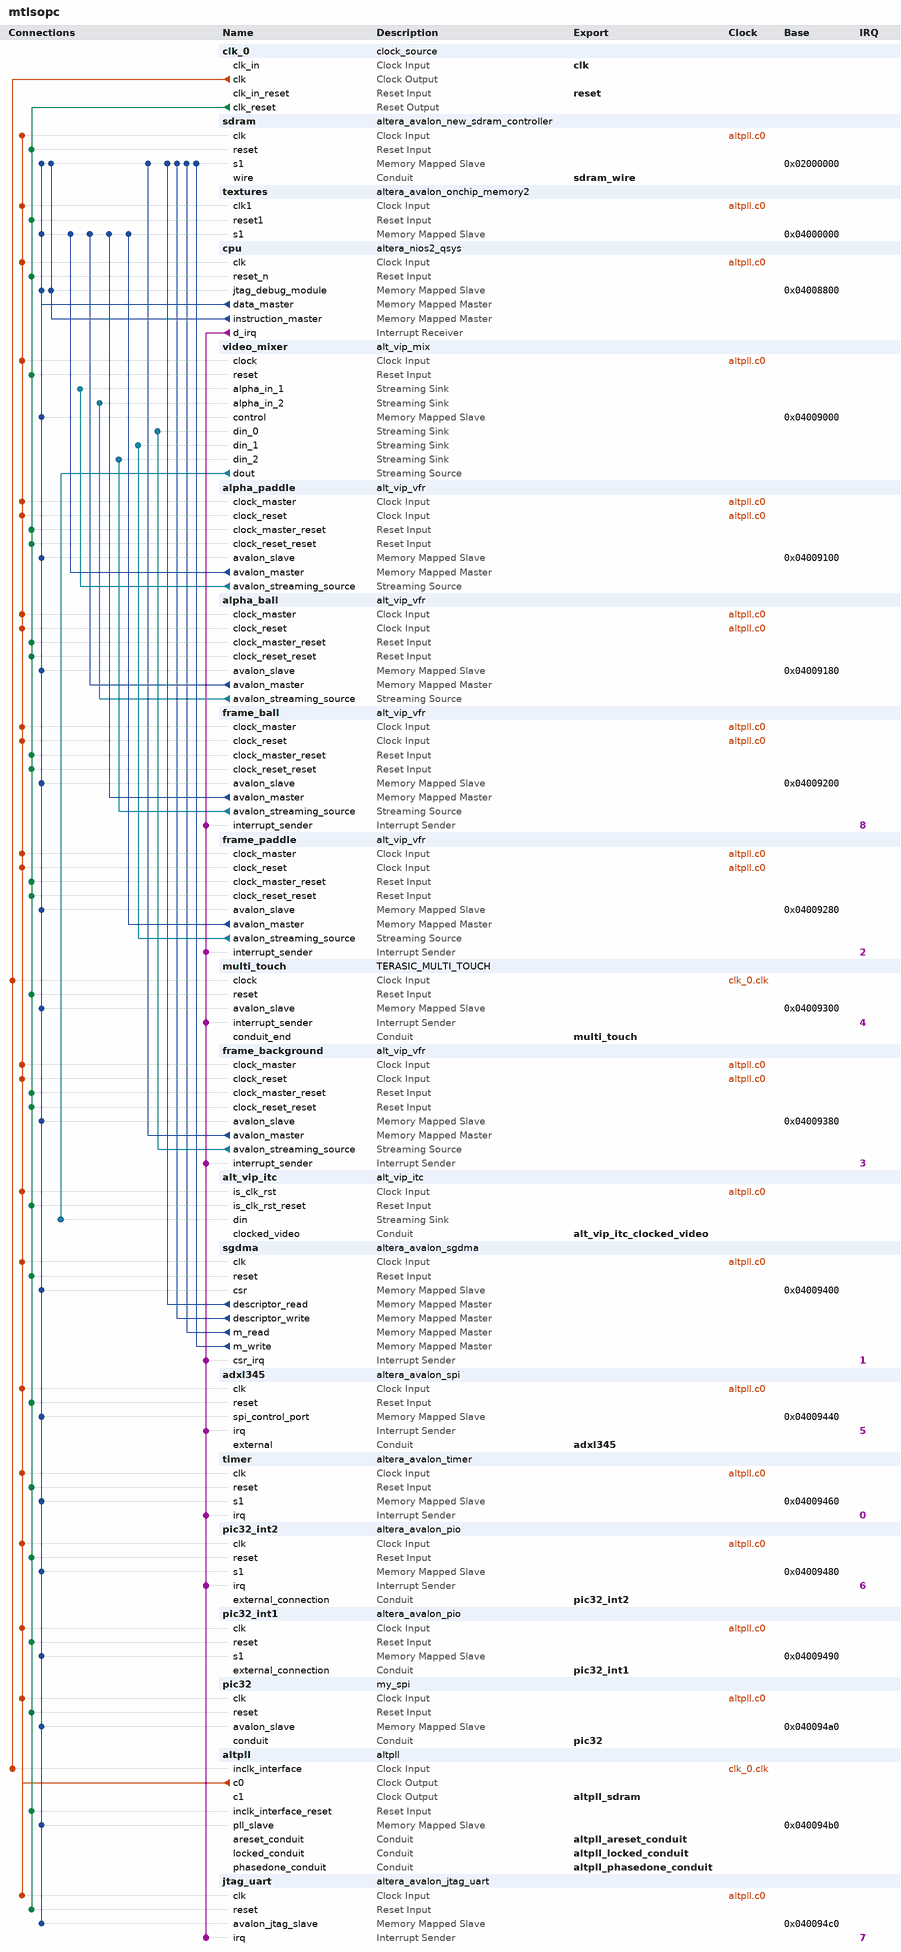
[diagram p0: system contents]
# Platform Designer (Qsys) system mtlsopc, Cyclone IV E EP4CE22F17C6
# Parameters at their usual value, and those the tool derives, are not listed.
package require -exact qsys 13.1
create_system mtlsopc
set_project_property DEVICE_FAMILY {Cyclone IV E}
set_project_property DEVICE EP4CE22F17C6

add_instance clk_0 clock_source 13.1
set_instance_parameter_value clk_0 clockFrequency 50000000

add_instance sdram altera_avalon_new_sdram_controller 13.1
set_instance_parameter_value sdram TAC 5.5
set_instance_parameter_value sdram TRCD 20.0
set_instance_parameter_value sdram TRP 20.0
set_instance_parameter_value sdram casLatency 2
set_instance_parameter_value sdram columnWidth 9
set_instance_parameter_value sdram dataWidth 16
set_instance_parameter_value sdram generateSimulationModel false
set_instance_parameter_value sdram model single_Micron_MT48LC4M32B2_7_chip
set_instance_parameter_value sdram numberOfBanks 4
set_instance_parameter_value sdram numberOfChipSelects 1
set_instance_parameter_value sdram powerUpDelay 100.0
set_instance_parameter_value sdram refreshPeriod 15.625
set_instance_parameter_value sdram rowWidth 13

add_instance textures altera_avalon_onchip_memory2 13.1
set_instance_parameter_value textures dataWidth 32
set_instance_parameter_value textures dualPort false
set_instance_parameter_value textures initMemContent true
set_instance_parameter_value textures initializationFileName onchip_mem.hex
set_instance_parameter_value textures memorySize 32768
set_instance_parameter_value textures singleClockOperation true

add_instance cpu altera_nios2_qsys 13.1
set_instance_parameter_value cpu resetSlave sdram.s1
set_instance_parameter_value cpu mmu_TLBMissExcSlave None
set_instance_parameter_value cpu exceptionSlave sdram.s1
set_instance_parameter_value cpu breakSlave cpu.jtag_debug_module
set_instance_parameter_value cpu impl Fast
set_instance_parameter_value cpu icache_size 4096
set_instance_parameter_value cpu dcache_size 4096

add_instance video_mixer alt_vip_mix 13.1
set_instance_parameter_value video_mixer PARAMETERISATION {<mixerParams><MIX_NAME>mixer</MIX_NAME><MIX_ALPHA_ENABLED>true</MIX_ALPHA_ENABLED><MIX_ALPHA_BPS>8</MIX_ALPHA_BPS><MIX_CHANNELS_IN_SEQ>1</MIX_CHANNELS_IN_SEQ><MIX_CHANNELS_IN_PAR>3</MIX_CHANNELS_IN_PAR><MIX_BPS>8</MIX_BPS><MIX_NUM_LAYERS>3</MIX_NUM_LAYERS><MIX_RUNTIME_MAX_WIDTH>800</MIX_RUNTIME_MAX_WIDTH><MIX_RUNTIME_MAX_HEIGHT>480</MIX_RUNTIME_MAX_HEIGHT></mixerParams>}

add_instance alpha_paddle alt_vip_vfr 13.1
set_instance_parameter_value alpha_paddle NUMBER_OF_CHANNELS_IN_PARALLEL 1
set_instance_parameter_value alpha_paddle MAX_IMAGE_WIDTH 256
set_instance_parameter_value alpha_paddle MAX_IMAGE_HEIGHT 32
set_instance_parameter_value alpha_paddle MEM_PORT_WIDTH 32
set_instance_parameter_value alpha_paddle RMASTER_FIFO_DEPTH 128
set_instance_parameter_value alpha_paddle CLOCKS_ARE_SEPARATE 0

add_instance alpha_ball alt_vip_vfr 13.1
set_instance_parameter_value alpha_ball NUMBER_OF_CHANNELS_IN_PARALLEL 1
set_instance_parameter_value alpha_ball MAX_IMAGE_WIDTH 32
set_instance_parameter_value alpha_ball MAX_IMAGE_HEIGHT 32
set_instance_parameter_value alpha_ball MEM_PORT_WIDTH 32
set_instance_parameter_value alpha_ball RMASTER_FIFO_DEPTH 128
set_instance_parameter_value alpha_ball CLOCKS_ARE_SEPARATE 0

add_instance frame_ball alt_vip_vfr 13.1
set_instance_parameter_value frame_ball NUMBER_OF_CHANNELS_IN_PARALLEL 3
set_instance_parameter_value frame_ball MAX_IMAGE_WIDTH 32
set_instance_parameter_value frame_ball MAX_IMAGE_HEIGHT 32
set_instance_parameter_value frame_ball MEM_PORT_WIDTH 32
set_instance_parameter_value frame_ball RMASTER_FIFO_DEPTH 128
set_instance_parameter_value frame_ball CLOCKS_ARE_SEPARATE 0

add_instance frame_paddle alt_vip_vfr 13.1
set_instance_parameter_value frame_paddle NUMBER_OF_CHANNELS_IN_PARALLEL 3
set_instance_parameter_value frame_paddle MAX_IMAGE_WIDTH 256
set_instance_parameter_value frame_paddle MAX_IMAGE_HEIGHT 32
set_instance_parameter_value frame_paddle MEM_PORT_WIDTH 32
set_instance_parameter_value frame_paddle RMASTER_FIFO_DEPTH 128
set_instance_parameter_value frame_paddle CLOCKS_ARE_SEPARATE 0

add_instance multi_touch TERASIC_MULTI_TOUCH 1.0

add_instance frame_background alt_vip_vfr 13.1
set_instance_parameter_value frame_background NUMBER_OF_CHANNELS_IN_PARALLEL 3
set_instance_parameter_value frame_background MAX_IMAGE_WIDTH 800
set_instance_parameter_value frame_background MAX_IMAGE_HEIGHT 480
set_instance_parameter_value frame_background MEM_PORT_WIDTH 32
set_instance_parameter_value frame_background RMASTER_FIFO_DEPTH 128
set_instance_parameter_value frame_background CLOCKS_ARE_SEPARATE 0

add_instance alt_vip_itc alt_vip_itc 13.1
set_instance_parameter_value alt_vip_itc NUMBER_OF_COLOUR_PLANES 3
set_instance_parameter_value alt_vip_itc INTERLACED 1
set_instance_parameter_value alt_vip_itc H_ACTIVE_PIXELS 800
set_instance_parameter_value alt_vip_itc V_ACTIVE_LINES 480
set_instance_parameter_value alt_vip_itc FIFO_DEPTH 800
set_instance_parameter_value alt_vip_itc THRESHOLD 799
set_instance_parameter_value alt_vip_itc H_SYNC_LENGTH 30
set_instance_parameter_value alt_vip_itc H_FRONT_PORCH 210
set_instance_parameter_value alt_vip_itc H_BACK_PORCH 16
set_instance_parameter_value alt_vip_itc V_SYNC_LENGTH 13
set_instance_parameter_value alt_vip_itc V_FRONT_PORCH 22
set_instance_parameter_value alt_vip_itc V_BACK_PORCH 10

add_instance sgdma altera_avalon_sgdma 13.1
set_instance_parameter_value sgdma enableBurstTransfers false
set_instance_parameter_value sgdma enableUnalignedTransfers false
set_instance_parameter_value sgdma readBlockDataWidth 16
set_instance_parameter_value sgdma sinkErrorWidth 0
set_instance_parameter_value sgdma sourceErrorWidth 0
set_instance_parameter_value sgdma transferMode MEMORY_TO_MEMORY
set_instance_parameter_value sgdma writeBurstcountWidth 4

add_instance adxl345 altera_avalon_spi 13.1
set_instance_parameter_value adxl345 clockPhase 1
set_instance_parameter_value adxl345 clockPolarity 1
set_instance_parameter_value adxl345 dataWidth 8
set_instance_parameter_value adxl345 masterSPI true
set_instance_parameter_value adxl345 numberOfSlaves 1
set_instance_parameter_value adxl345 targetClockRate 2000000

add_instance timer altera_avalon_timer 13.1
set_instance_parameter_value timer period 1
set_instance_parameter_value timer periodUnits MSEC

add_instance pic32_int2 altera_avalon_pio 13.1
set_instance_parameter_value pic32_int2 bitClearingEdgeCapReg true
set_instance_parameter_value pic32_int2 captureEdge true
set_instance_parameter_value pic32_int2 direction Input
set_instance_parameter_value pic32_int2 generateIRQ true
set_instance_parameter_value pic32_int2 irqType EDGE
set_instance_parameter_value pic32_int2 width 1

add_instance pic32_int1 altera_avalon_pio 13.1
set_instance_parameter_value pic32_int1 direction Output
set_instance_parameter_value pic32_int1 width 1

add_instance pic32 my_spi 1.0

add_instance altpll altpll 13.1
set_instance_parameter_value altpll INCLK0_INPUT_FREQUENCY 20000
set_instance_parameter_value altpll CLK0_MULTIPLY_BY 2
set_instance_parameter_value altpll CLK1_MULTIPLY_BY 2
set_instance_parameter_value altpll CLK0_DIVIDE_BY 1
set_instance_parameter_value altpll CLK1_DIVIDE_BY 1
set_instance_parameter_value altpll CLK1_PHASE_SHIFT -3000
set_instance_parameter_value altpll CLK1_DUTY_CYCLE 50
set_instance_parameter_value altpll PORT_clk1 PORT_USED
set_instance_parameter_value altpll PORT_clk2 PORT_UNUSED
set_instance_parameter_value altpll PORT_clk3 PORT_UNUSED
set_instance_parameter_value altpll PORT_ARESET PORT_UNUSED
set_instance_parameter_value altpll PORT_LOCKED PORT_UNUSED

add_instance jtag_uart altera_avalon_jtag_uart 13.1
set_instance_parameter_value jtag_uart simInteractiveOptions NO_INTERACTIVE_WINDOWS

# connections
add_connection altpll.c0 adxl345.clk clock
add_connection altpll.c0 alpha_ball.clock_master clock
add_connection altpll.c0 alpha_ball.clock_reset clock
add_connection altpll.c0 alpha_paddle.clock_master clock
add_connection altpll.c0 alpha_paddle.clock_reset clock
add_connection altpll.c0 alt_vip_itc.is_clk_rst clock
add_connection altpll.c0 cpu.clk clock
add_connection altpll.c0 frame_background.clock_master clock
add_connection altpll.c0 frame_background.clock_reset clock
add_connection altpll.c0 frame_ball.clock_master clock
add_connection altpll.c0 frame_ball.clock_reset clock
add_connection altpll.c0 frame_paddle.clock_master clock
add_connection altpll.c0 frame_paddle.clock_reset clock
add_connection altpll.c0 jtag_uart.clk clock
add_connection altpll.c0 pic32.clk clock
add_connection altpll.c0 pic32_int1.clk clock
add_connection altpll.c0 pic32_int2.clk clock
add_connection altpll.c0 sdram.clk clock
add_connection altpll.c0 sgdma.clk clock
add_connection altpll.c0 textures.clk1 clock
add_connection altpll.c0 timer.clk clock
add_connection altpll.c0 video_mixer.clock clock
add_connection clk_0.clk altpll.inclk_interface clock
add_connection clk_0.clk multi_touch.clock clock
add_connection clk_0.clk_reset adxl345.reset reset
add_connection clk_0.clk_reset alpha_ball.clock_master_reset reset
add_connection clk_0.clk_reset alpha_ball.clock_reset_reset reset
add_connection clk_0.clk_reset alpha_paddle.clock_master_reset reset
add_connection clk_0.clk_reset alpha_paddle.clock_reset_reset reset
add_connection clk_0.clk_reset alt_vip_itc.is_clk_rst_reset reset
add_connection clk_0.clk_reset altpll.inclk_interface_reset reset
add_connection clk_0.clk_reset cpu.reset_n reset
add_connection clk_0.clk_reset frame_background.clock_master_reset reset
add_connection clk_0.clk_reset frame_background.clock_reset_reset reset
add_connection clk_0.clk_reset frame_ball.clock_master_reset reset
add_connection clk_0.clk_reset frame_ball.clock_reset_reset reset
add_connection clk_0.clk_reset frame_paddle.clock_master_reset reset
add_connection clk_0.clk_reset frame_paddle.clock_reset_reset reset
add_connection clk_0.clk_reset jtag_uart.reset reset
add_connection clk_0.clk_reset multi_touch.reset reset
add_connection clk_0.clk_reset pic32.reset reset
add_connection clk_0.clk_reset pic32_int1.reset reset
add_connection clk_0.clk_reset pic32_int2.reset reset
add_connection clk_0.clk_reset sdram.reset reset
add_connection clk_0.clk_reset sgdma.reset reset
add_connection clk_0.clk_reset textures.reset1 reset
add_connection clk_0.clk_reset timer.reset reset
add_connection clk_0.clk_reset video_mixer.reset reset
add_connection alpha_ball.avalon_master textures.s1 avalon
set_connection_parameter_value alpha_ball.avalon_master/textures.s1 baseAddress 0x04000000
add_connection alpha_paddle.avalon_master textures.s1 avalon
set_connection_parameter_value alpha_paddle.avalon_master/textures.s1 baseAddress 0x04000000
add_connection cpu.data_master adxl345.spi_control_port avalon
set_connection_parameter_value cpu.data_master/adxl345.spi_control_port baseAddress 0x04009440
add_connection cpu.data_master alpha_ball.avalon_slave avalon
set_connection_parameter_value cpu.data_master/alpha_ball.avalon_slave baseAddress 0x04009180
add_connection cpu.data_master alpha_paddle.avalon_slave avalon
set_connection_parameter_value cpu.data_master/alpha_paddle.avalon_slave baseAddress 0x04009100
add_connection cpu.data_master altpll.pll_slave avalon
set_connection_parameter_value cpu.data_master/altpll.pll_slave baseAddress 0x040094b0
add_connection cpu.data_master cpu.jtag_debug_module avalon
set_connection_parameter_value cpu.data_master/cpu.jtag_debug_module baseAddress 0x04008800
add_connection cpu.data_master frame_background.avalon_slave avalon
set_connection_parameter_value cpu.data_master/frame_background.avalon_slave baseAddress 0x04009380
add_connection cpu.data_master frame_ball.avalon_slave avalon
set_connection_parameter_value cpu.data_master/frame_ball.avalon_slave baseAddress 0x04009200
add_connection cpu.data_master frame_paddle.avalon_slave avalon
set_connection_parameter_value cpu.data_master/frame_paddle.avalon_slave baseAddress 0x04009280
add_connection cpu.data_master jtag_uart.avalon_jtag_slave avalon
set_connection_parameter_value cpu.data_master/jtag_uart.avalon_jtag_slave baseAddress 0x040094c0
add_connection cpu.data_master multi_touch.avalon_slave avalon
set_connection_parameter_value cpu.data_master/multi_touch.avalon_slave baseAddress 0x04009300
add_connection cpu.data_master pic32.avalon_slave avalon
set_connection_parameter_value cpu.data_master/pic32.avalon_slave baseAddress 0x040094a0
add_connection cpu.data_master pic32_int1.s1 avalon
set_connection_parameter_value cpu.data_master/pic32_int1.s1 baseAddress 0x04009490
add_connection cpu.data_master pic32_int2.s1 avalon
set_connection_parameter_value cpu.data_master/pic32_int2.s1 baseAddress 0x04009480
add_connection cpu.data_master sdram.s1 avalon
set_connection_parameter_value cpu.data_master/sdram.s1 baseAddress 0x02000000
add_connection cpu.data_master sgdma.csr avalon
set_connection_parameter_value cpu.data_master/sgdma.csr baseAddress 0x04009400
add_connection cpu.data_master textures.s1 avalon
set_connection_parameter_value cpu.data_master/textures.s1 baseAddress 0x04000000
add_connection cpu.data_master timer.s1 avalon
set_connection_parameter_value cpu.data_master/timer.s1 baseAddress 0x04009460
add_connection cpu.data_master video_mixer.control avalon
set_connection_parameter_value cpu.data_master/video_mixer.control baseAddress 0x04009000
add_connection cpu.instruction_master cpu.jtag_debug_module avalon
set_connection_parameter_value cpu.instruction_master/cpu.jtag_debug_module baseAddress 0x04008800
add_connection cpu.instruction_master sdram.s1 avalon
set_connection_parameter_value cpu.instruction_master/sdram.s1 baseAddress 0x02000000
add_connection frame_background.avalon_master sdram.s1 avalon
set_connection_parameter_value frame_background.avalon_master/sdram.s1 baseAddress 0x02000000
add_connection frame_ball.avalon_master textures.s1 avalon
set_connection_parameter_value frame_ball.avalon_master/textures.s1 baseAddress 0x04000000
add_connection frame_paddle.avalon_master textures.s1 avalon
set_connection_parameter_value frame_paddle.avalon_master/textures.s1 baseAddress 0x04000000
add_connection sgdma.descriptor_read sdram.s1 avalon
set_connection_parameter_value sgdma.descriptor_read/sdram.s1 baseAddress 0x02000000
add_connection sgdma.descriptor_write sdram.s1 avalon
set_connection_parameter_value sgdma.descriptor_write/sdram.s1 baseAddress 0x02000000
add_connection sgdma.m_read sdram.s1 avalon
set_connection_parameter_value sgdma.m_read/sdram.s1 baseAddress 0x02000000
add_connection sgdma.m_write sdram.s1 avalon
set_connection_parameter_value sgdma.m_write/sdram.s1 baseAddress 0x02000000
add_connection alpha_ball.avalon_streaming_source video_mixer.alpha_in_2 avalon_streaming
add_connection alpha_paddle.avalon_streaming_source video_mixer.alpha_in_1 avalon_streaming
add_connection frame_background.avalon_streaming_source video_mixer.din_0 avalon_streaming
add_connection frame_ball.avalon_streaming_source video_mixer.din_2 avalon_streaming
add_connection frame_paddle.avalon_streaming_source video_mixer.din_1 avalon_streaming
add_connection video_mixer.dout alt_vip_itc.din avalon_streaming
add_connection cpu.d_irq adxl345.irq interrupt
set_connection_parameter_value cpu.d_irq/adxl345.irq irqNumber 5
add_connection cpu.d_irq frame_background.interrupt_sender interrupt
set_connection_parameter_value cpu.d_irq/frame_background.interrupt_sender irqNumber 3
add_connection cpu.d_irq frame_ball.interrupt_sender interrupt
set_connection_parameter_value cpu.d_irq/frame_ball.interrupt_sender irqNumber 8
add_connection cpu.d_irq frame_paddle.interrupt_sender interrupt
set_connection_parameter_value cpu.d_irq/frame_paddle.interrupt_sender irqNumber 2
add_connection cpu.d_irq jtag_uart.irq interrupt
set_connection_parameter_value cpu.d_irq/jtag_uart.irq irqNumber 7
add_connection cpu.d_irq multi_touch.interrupt_sender interrupt
set_connection_parameter_value cpu.d_irq/multi_touch.interrupt_sender irqNumber 4
add_connection cpu.d_irq pic32_int2.irq interrupt
set_connection_parameter_value cpu.d_irq/pic32_int2.irq irqNumber 6
add_connection cpu.d_irq sgdma.csr_irq interrupt
set_connection_parameter_value cpu.d_irq/sgdma.csr_irq irqNumber 1
add_connection cpu.d_irq timer.irq interrupt
set_connection_parameter_value cpu.d_irq/timer.irq irqNumber 0

# exported interfaces
add_interface clk clock sink
set_interface_property clk EXPORT_OF clk_0.clk_in
add_interface reset reset sink
set_interface_property reset EXPORT_OF clk_0.clk_in_reset
add_interface sdram_wire conduit end
set_interface_property sdram_wire EXPORT_OF sdram.wire
add_interface alt_vip_itc_clocked_video conduit end
set_interface_property alt_vip_itc_clocked_video EXPORT_OF alt_vip_itc.clocked_video
add_interface multi_touch conduit end
set_interface_property multi_touch EXPORT_OF multi_touch.conduit_end
add_interface altpll_sdram clock source
set_interface_property altpll_sdram EXPORT_OF altpll.c1
add_interface altpll_areset_conduit conduit end
set_interface_property altpll_areset_conduit EXPORT_OF altpll.areset_conduit
add_interface altpll_locked_conduit conduit end
set_interface_property altpll_locked_conduit EXPORT_OF altpll.locked_conduit
add_interface altpll_phasedone_conduit conduit end
set_interface_property altpll_phasedone_conduit EXPORT_OF altpll.phasedone_conduit
add_interface pic32 conduit end
set_interface_property pic32 EXPORT_OF pic32.conduit
add_interface pic32_int1 conduit end
set_interface_property pic32_int1 EXPORT_OF pic32_int1.external_connection
add_interface pic32_int2 conduit end
set_interface_property pic32_int2 EXPORT_OF pic32_int2.external_connection
add_interface adxl345 conduit end
set_interface_property adxl345 EXPORT_OF adxl345.external

set_interconnect_requirement {$system} qsys_mm.clockCrossingAdapter FIFO
set_interconnect_requirement {$system} qsys_mm.maxAdditionalLatency 1
set_interconnect_requirement {$system} qsys_mm.insertDefaultSlave false

save_system mtlsopc.qsys
